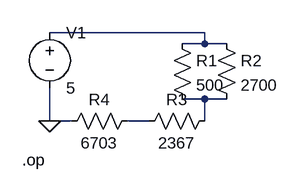
[diagram p0: schematic Simulation3.asc]
Simulation3.asc, the LTspice schematic file:
Version 4
SHEET 1 880 680
WIRE 320 128 96 128
WIRE 320 144 320 128
WIRE 320 144 288 144
WIRE 352 144 320 144
WIRE 320 224 288 224
WIRE 352 224 320 224
WIRE 96 256 96 208
WIRE 128 256 96 256
WIRE 240 256 208 256
WIRE 320 256 320 224
FLAG 96 256 0
DATAFLAG 224 128 ""
DATAFLAG 224 256 ""
DATAFLAG 96 240 ""
DATAFLAG 320 128 ""
DATAFLAG 320 256 ""
SYMBOL res 272 128 R0
SYMATTR InstName R1
SYMATTR Value 500
SYMBOL res 336 128 R0
SYMATTR InstName R2
SYMATTR Value 2700
SYMBOL res 336 240 R90
WINDOW 0 0 56 VBottom 2
WINDOW 3 32 56 VTop 2
SYMATTR InstName R3
SYMATTR Value 2367
SYMBOL res 224 240 R90
WINDOW 0 0 56 VBottom 2
WINDOW 3 32 56 VTop 2
SYMATTR InstName R4
SYMATTR Value 6703
SYMBOL voltage 96 112 R0
WINDOW 123 0 0 Left 0
WINDOW 39 0 0 Left 0
SYMATTR InstName V1
SYMATTR Value 5
TEXT 56 312 Left 2 !.op

The netlist it stands for:
* Simulation3.asc
R1 N001 N002 500
R2 N001 N002 2700
R3 N002 N003 2367
R4 N003 0 6703
V1 N001 0 5
.op
.backanno
.end